# EAGLE schematic LockBox_ver2 (EAGLE 7.7.0)
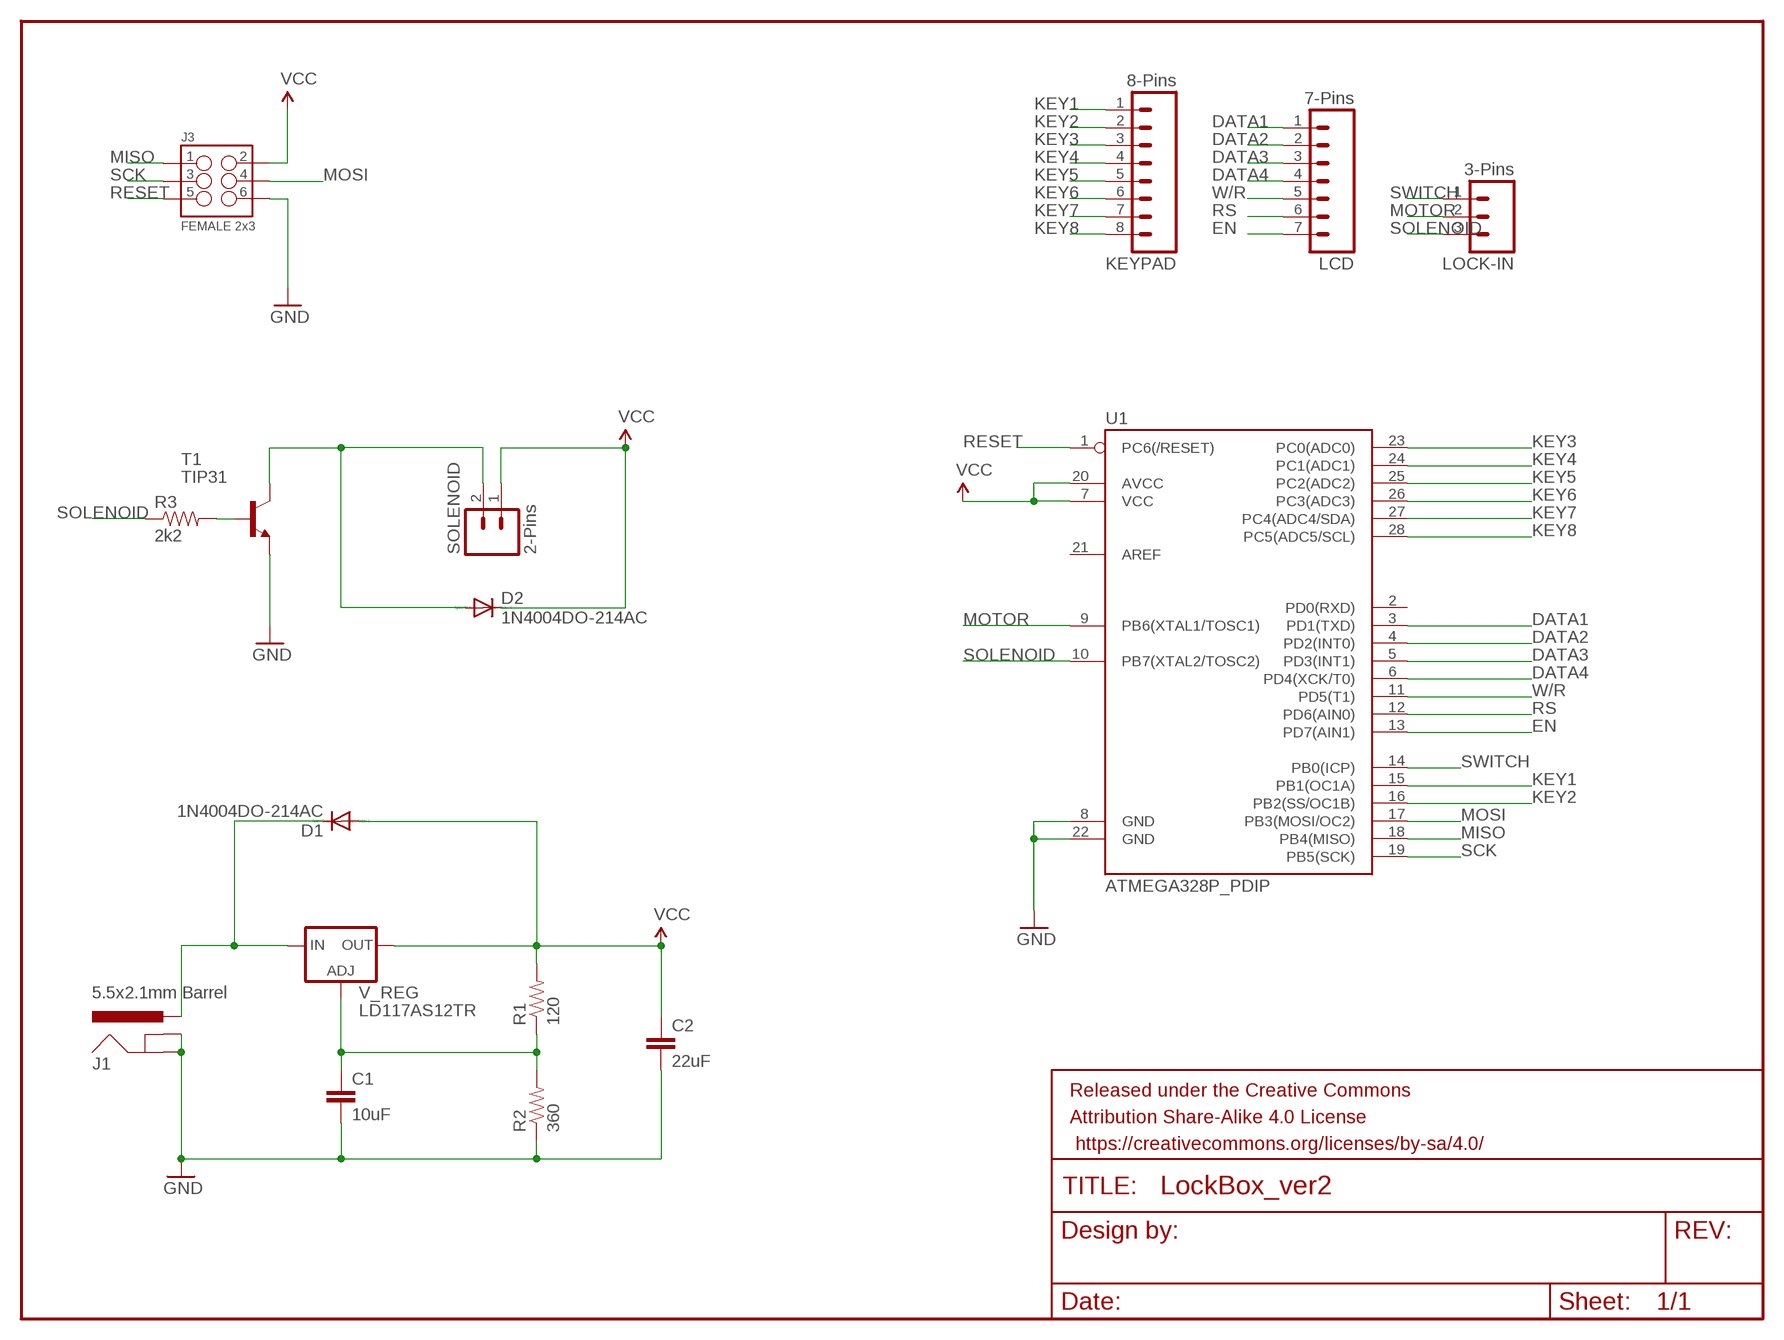
[diagram p0: schematic, sheet 1]

## Parts
C1  10uF  CAP0603-CAP  [0603-CAP]
C2  22uF  CAP0603-CAP  [0603-CAP]
D1  1N4004DO-214AC  [DO-214AC]
D2  1N4004DO-214AC  [DO-214AC]
FRAME1  FRAME-LETTER  [CREATIVE_COMMONS]
J1  5.5x2.1mm Barrel  POWER_JACKSMD  [POWER_JACK_SMD]
J3  FEMALE 2x3  M03X2FEMALE  [2X3]
KEYPAD  8-Pins  M08  [1X08_ROUND]
LCD  7-Pins  M07  [1X07]
LOCK-IN  3-Pins  M03PTH  [1X03]
R1  120  RESISTOR0603  [0603-RES]
R2  360  RESISTOR0603  [0603-RES]
R3  2k2  RESISTOR0603  [0603-RES]
SOLENOID  2-Pins  M02PTH  [1X02]
T1  TIP31  [TO220]
U1  ATMEGA328P_PDIP  [DIL28-3]
V_REG  LD117AS12TR  [SOT223]

## Nets
DATA1: LCD.1 U1.3(PD1(TXD))
DATA2: LCD.2 U1.4(PD2(INT0))
DATA3: LCD.3 U1.5(PD3(INT1))
DATA4: LCD.4 U1.6(PD4(XCK/T0))
EN: LCD.7 U1.13(PD7(AIN1))
GND: C1.2 C2.2 J1.GND(GNDBREAK) J1.P$4(GND) J3.6 R2.1 T1.3(E) U1.8(GND) U1.22(GND)
KEY1: KEYPAD.1 U1.15(PB1(OC1A))
KEY2: KEYPAD.2 U1.16(PB2(SS/OC1B))
KEY3: KEYPAD.3 U1.23(PC0(ADC0))
KEY4: KEYPAD.4 U1.24(PC1(ADC1))
KEY5: KEYPAD.5 U1.25(PC2(ADC2))
KEY6: KEYPAD.6 U1.26(PC3(ADC3))
KEY7: KEYPAD.7 U1.27(PC4(ADC4/SDA))
KEY8: KEYPAD.8 U1.28(PC5(ADC5/SCL))
MISO: J3.1 U1.18(PB4(MISO))
MOSI: J3.4 U1.17(PB3(MOSI/OC2))
MOTOR: LOCK-IN.2 U1.9(PB6(XTAL1/TOSC1))
N$2: R3.2 T1.1(B)
N$13: D1.C J1.VIN0(PWR) V_REG.3(IN)
N$14: C1.1 R1.1 R2.2 V_REG.1(ADJ)
RESET: J3.5 U1.1(PC6(/RESET))
RS: LCD.6 U1.12(PD6(AIN0))
SCK: J3.3 U1.19(PB5(SCK))
SOLENOID: LOCK-IN.3 R3.1 U1.10(PB7(XTAL2/TOSC2))
SOLENOID-: D2.A SOLENOID.2 T1.2(C)
SWITCH: LOCK-IN.1 U1.14(PB0(ICP))
VCC: C2.1 D1.A D2.C J3.2 R1.2 SOLENOID.1 U1.7(VCC) U1.20(AVCC) V_REG.4(OUT)
W/R: LCD.5 U1.11(PD5(T1))
Unconnected: U1.2(PD0(RXD)) U1.21(AREF)

## Library data of the parts
C1 C2 = SparkFun-Passives:CAP: Capacitor Standard 0603 ceramic capacitor, and 0.1" leaded capacitor.
D1 D2 = diode:1N4004: DIODE general purpose rectifier, 1 A
FRAME1 = SparkFun-Aesthetics:FRAME-LETTER: Schematic Frame Standard 8.5x11 US Letter frame
J1 = SparkFun-Connectors:POWER_JACK: Power Jack This is the standard 5.5mm barrel jack for power. The PTH is the most common, proven, reliable, footprint. The Slot footprint only works if the mill layer is transmitted to the PCB fab house so be warned. Mating wall wart : TOL-00298 (and others); PROD_ID: CONN-08106; SF_ID: PRT-12748
J3 = SparkFun-Connectors:M03X2: 2x3 .1" header. Shrouded, with keying- CONN-10681 SMT- CONN-11415 Pogo pins- HW-11044; PROD_ID: CONN-11566
KEYPAD = SparkFun-Connectors:M08: Header 8 Standard 8-pin 0.1" header. Use with straight break away headers (SKU : PRT-00116), right angle break away headers (PRT-00553), swiss pins (PRT-00743), machine pins (PRT-00117), and female headers (PRT-00115).; PROD_ID: CONN-08437
LCD = SparkFun-Connectors:M07: Header 7 Standard 7-pin 0.1" header. Use with straight break away headers (SKU : PRT-00116), right angle break away headers (PRT-00553), swiss pins (PRT-00743), machine pins (PRT-00117), and female headers (PRT-00115). NOTES ON THE VARIANTS LOCK and LOCK_LONGPADS... This footprint was designed to help hold the alignment of a through-hole component (i.e. 7-pin header) while soldering it into place. You may notice that each hole has been shifted either up or down by 0.005 of an inch from it's more standard position (which is usually a perfectly straight line). This slight alteration caused the pins (the squares in the middle) to touch the edges of the holes. Because they are alternating, it causes a "brace" to hold the header in place. 0.005 has proven to be the perfect amount of "off-center" position when using our standard breakaway headers. Although looks a little odd when you look at the bare footprint, once you have a header in there, the alteration is very hard to notice. Also, if you push a header all the way into place, it is covered up entirely on the bottom side. This idea of altering the position of holes to aid alignment will be further integrated into the Sparkfun Library for other footprints. It can help hold any component with 3 or more connection pins.
LOCK-IN = SparkFun-Connectors:M03: Header 3 Standard 3-pin 0.1" header. Use with straight break away headers (SKU : PRT-00116), right angle break away headers (PRT-00553), swiss pins (PRT-00743), machine pins (PRT-00117), and female headers (PRT-00115). Molex polarized connector foot print use with SKU : PRT-08232 with associated crimp pins and housings.
R1-R3 = SparkFun-Resistors:RESISTOR: Resistor Basic schematic elements and footprints for 0603, 1206, and PTH resistors.
SOLENOID = SparkFun-Connectors:M02: Standard 2-pin 0.1" header. Use with - straight break away headers ( PRT-00116) - right angle break away headers (PRT-00553) - swiss pins (PRT-00743) - machine pins (PRT-00117) - female headers (PRT-00115) Molex polarized connector foot print use with: PRT-08233 with associated crimp pins and housings. 2.54_SCREWTERM for use with PRT-10571. 3.5mm Screw Terminal footprints for PRT-08084 5mm Screw Terminal footprints for use with PRT-08432
T1 = transistor:TIP31: NPN Transistor Medium Power Linear Switching Applications Source: http://onsemi.com
U1 = SparkFun-DigitalIC:ATMEGA328P_PDIP: uC used in the Arduino 32kb flash, 1k EEPROM, 2k SRAM This is the through-hole version of this chip.
V_REG = v-reg:LD117A?*: Low drop fixed and adjustable positive voltage regulators 1 A Source: http://www.st.com/stonline/products/literature/ds/7194/ld1117axx.pdf